# Altium project ESP232_USB_C_1.PrjPcb
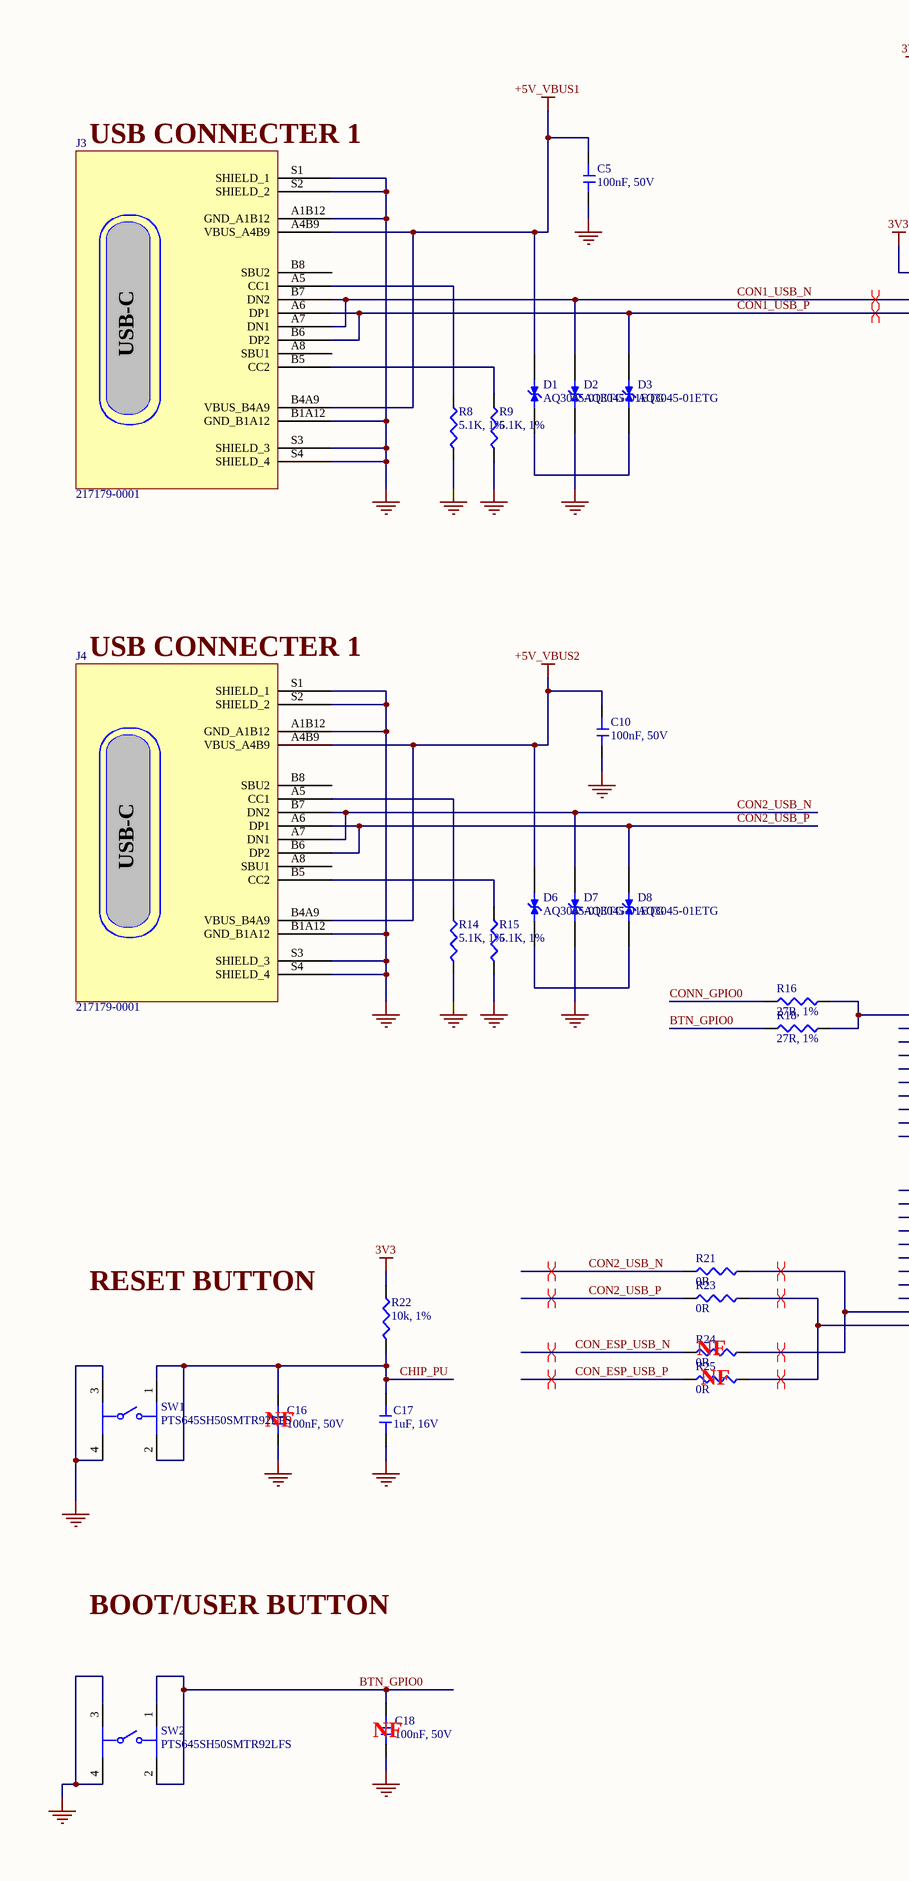
[diagram p0: ESP232_USB_C_SCH_1.SchDoc, left]
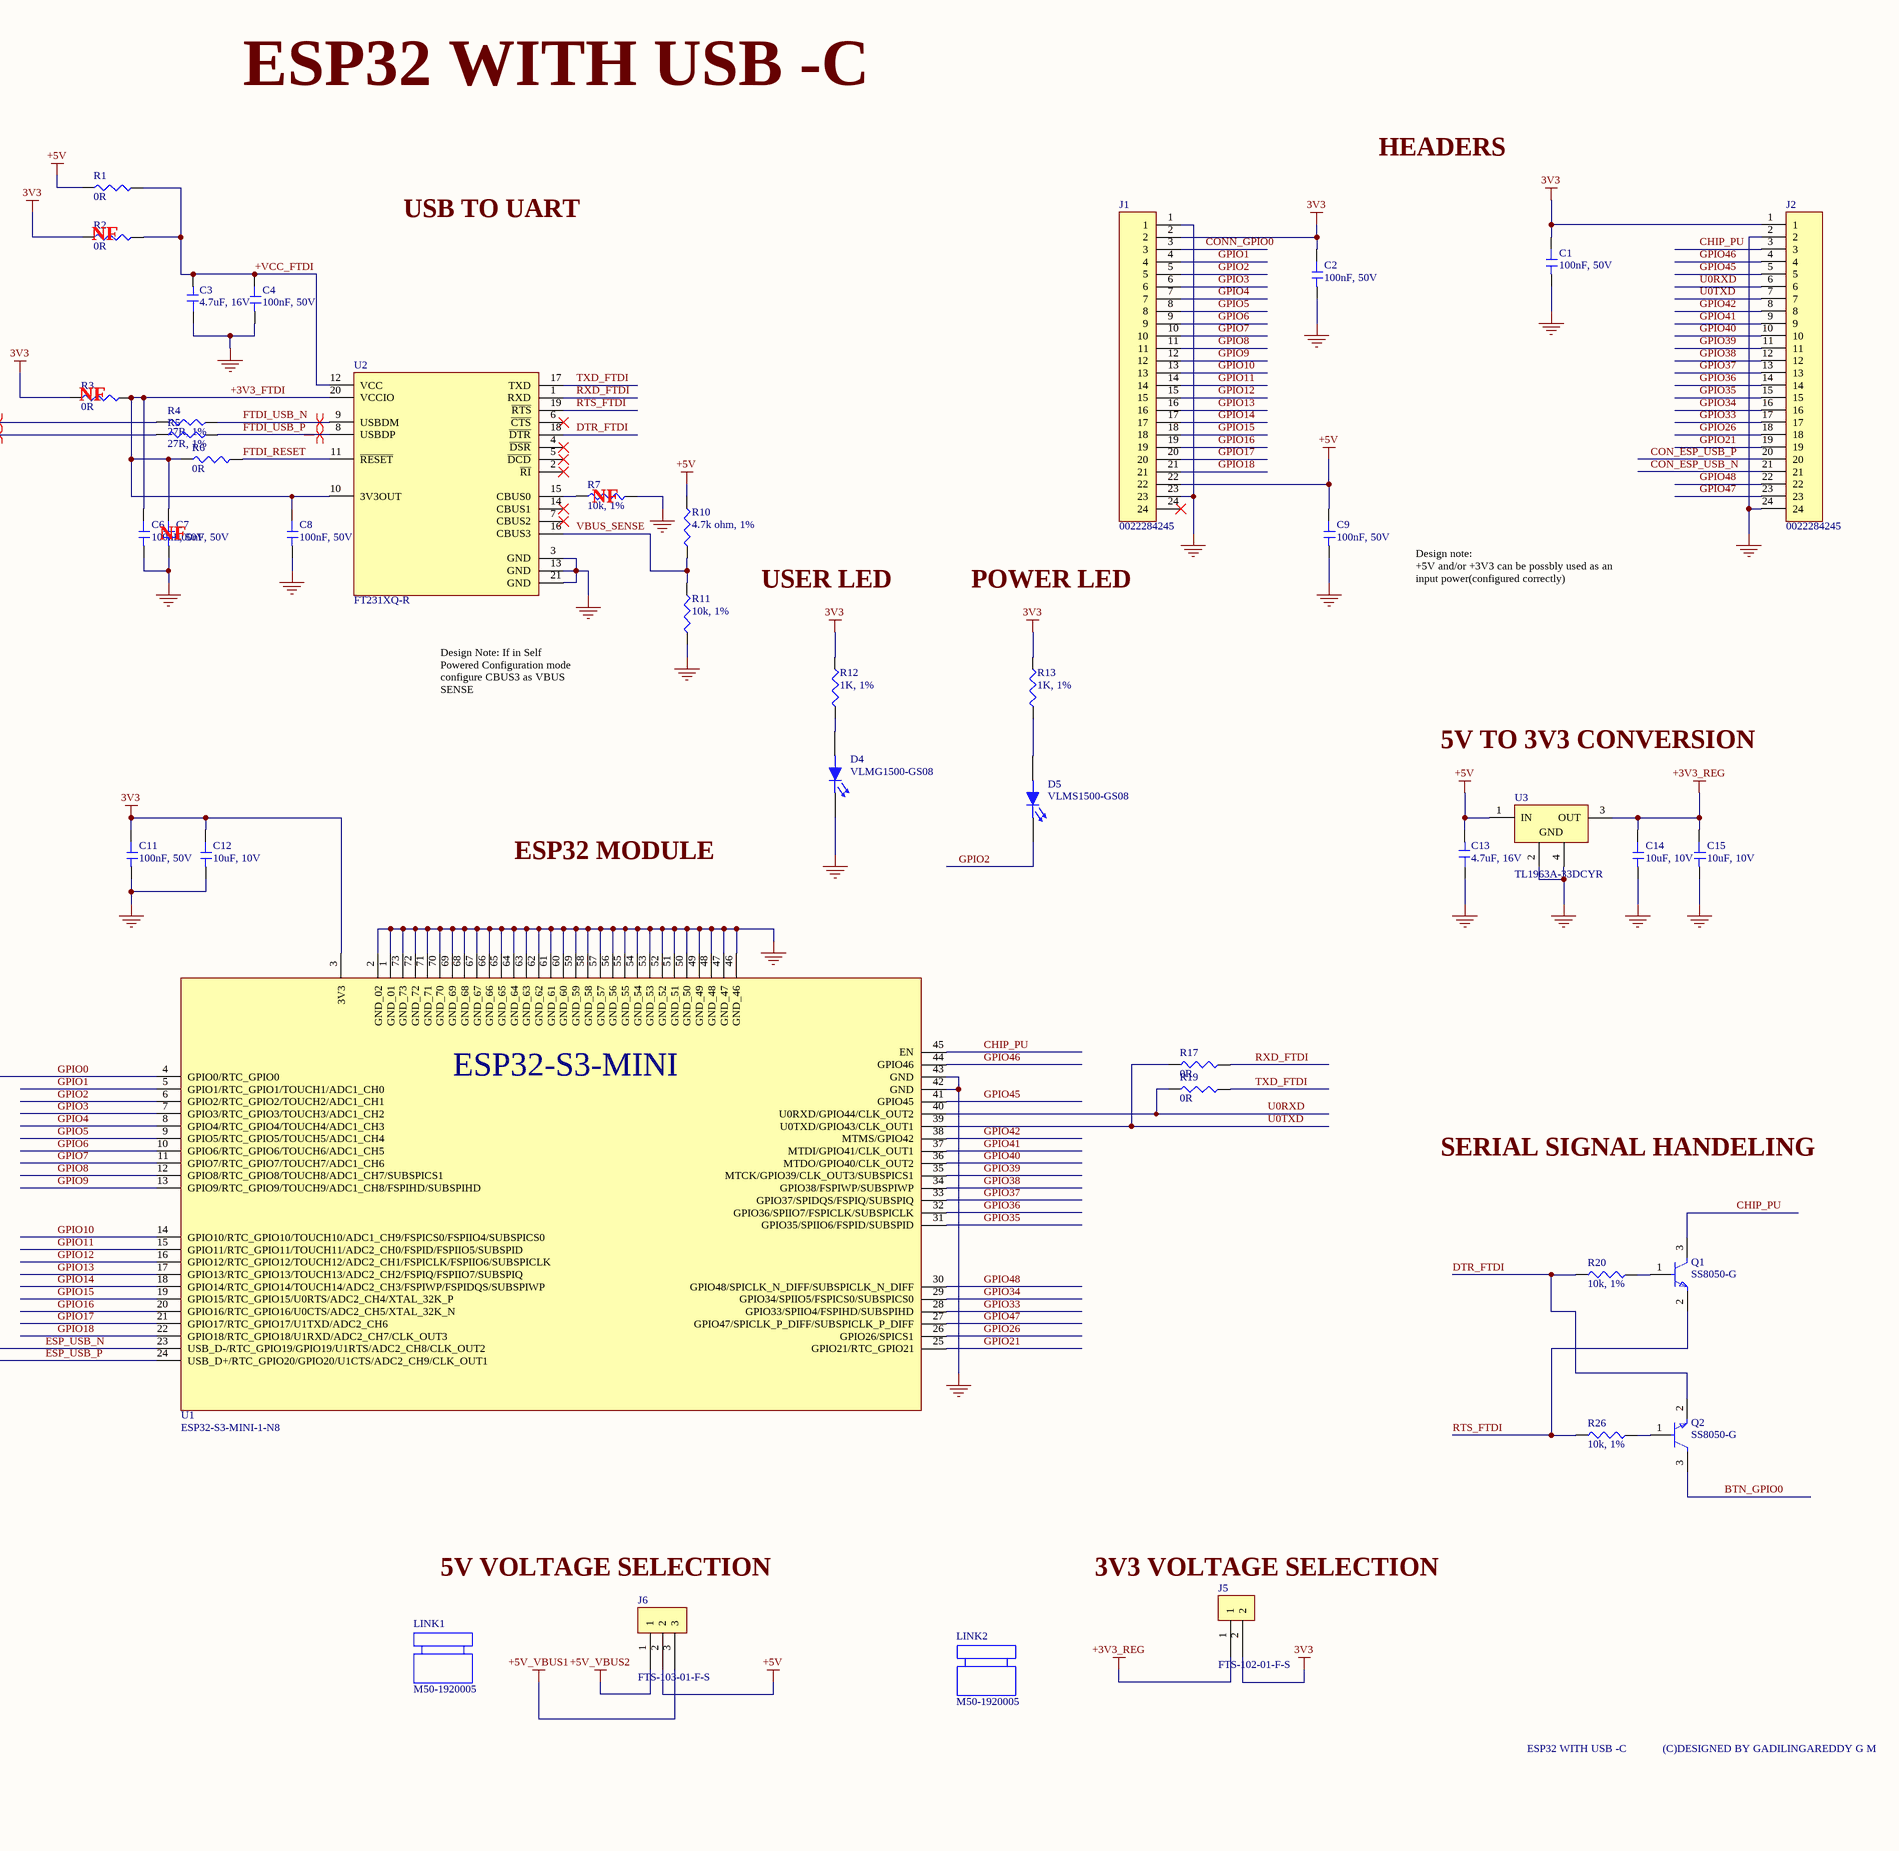
[diagram p1: ESP232_USB_C_SCH_1.SchDoc, right]
1 sheet, 67 parts. Net scope: global (net labels, ports and power ports of the same name join across sheets).
Board file: ESP232_USB_C_V1_2..PcbDoc

## Sheet ESP232_USB_C_SCH_1.SchDoc
size A2; SheetNumber: 1; SheetTotal: 1

### Parts
C1  100nF, 50V  [CAPC1005X55N]
C2  100nF, 50V  [CAPC1005X55N]
C3  4.7uF, 16V  [CAPC1005X55N]
C4  100nF, 50V  [CAPC1005X55N]
C5  100nF, 50V  [CAPC1005X55N]
C6  100nF, 50V  [CAPC1005X55N]
C7  100nF, 50V  [CAPC1005X55N]
C8  100nF, 50V  [CAPC1005X55N]
C9  100nF, 50V  [CAPC1005X55N]
C10  100nF, 50V  [CAPC1005X55N]
C11  100nF, 50V  [CAPC1005X55N]
C12  10uF, 10V  [CAPC1005X55N]
C13  4.7uF, 16V  [CAPC1005X55N]
C14  10uF, 10V  [CAPC1005X55N]
C15  10uF, 10V  [CAPC1005X55N]
C16  100nF, 50V  [CAPC1005X55N]
C17  1uF, 16V  [CAPC1005X55N]
C18  100nF, 50V  [CAPC1005X55N]
D1  AQ3045-01ETG  [ESD_TVS_DIODE]
D2  AQ3045-01ETG  [ESD_TVS_DIODE]
D3  AQ3045-01ETG  [ESD_TVS_DIODE]
D4  VLMG1500-GS08  [GREEN_LED]
D5  VLMS1500-GS08  [RED_LED]
D6  AQ3045-01ETG  [ESD_TVS_DIODE]
D7  AQ3045-01ETG  [ESD_TVS_DIODE]
D8  AQ3045-01ETG  [ESD_TVS_DIODE]
J1  0022284245  [HDR_1X24_2.54MM - duplicate]
J2  0022284245  [HDR_1X24_2.54MM - duplicate]
J3  217179-0001  [FP-2171790001-MFG]
J4  217179-0001  [FP-2171790001-MFG]
J5  FTS-102-01-F-S  [HDR_1X2_1.27MM]
J6  FTS-103-01-F-S  [HDR_1X3_1.27MM]
LINK1  M50-1920005  (mechanical)
LINK2  M50-1920005  (mechanical)
Q1  SS8050-G  [FP-SS8050-G-IPC_B]
Q2  SS8050-G  [FP-SS8050-G-IPC_B]
R1  0R  [RESC1005X37N]
R2  0R  [RESC1005X37N]
R3  0R  [RESC1005X37N]
R4  27R, 1%  [RESC1005X37N]
R5  27R, 1%  [RESC1005X37N]
R6  0R  [RESC1005X37N]
R7  10k, 1%  [RESC1005X37N]
R8  5.1K, 1%  [RESC1005X37N]
R9  5.1K, 1%  [RESC1005X37N]
R10  4.7k ohm, 1%  [RESC1005X37N]
R11  10k, 1%  [RESC1005X37N]
R12  1K, 1%  [RESC1005X37N]
R13  1K, 1%  [RESC1005X37N]
R14  5.1K, 1%  [RESC1005X37N]
R15  5.1K, 1%  [RESC1005X37N]
R16  27R, 1%  [RESC1005X37N]
R17  0R  [RESC1005X37N]
R18  27R, 1%  [RESC1005X37N]
R19  0R  [RESC1005X37N]
R20  10k, 1%  [RESC1005X37N]
R21  0R  [RESC1005X37N]
R22  10k, 1%  [RESC1005X37N]
R23  0R  [RESC1005X37N]
R24  0R  [RESC1005X37N]
R25  0R  [RESC1005X37N]
R26  10k, 1%  [RESC1005X37N]
SW1  PTS645SH50SMTR92LFS  [FP-PTS645SH50SMTR92LFS-MFG]
SW2  PTS645SH50SMTR92LFS  [FP-PTS645SH50SMTR92LFS-MFG]
U1  ESP32-S3-MINI-1-N8  [ESP32-S3-MINI-1-N8]
U2  FT231XQ-R  [FP-QFN-20-IPC_B]
U3  TL1963A-33DCYR  [DCY0004A_N]

### Nets
3V3: C1.2 C2.2 C11.2 C12.2 J1.2 J2.1 J5.2 R2.1 R3.1 R12.1 R13.1 R22.2 U1.3(3V3)
+3V3_REG: C14.2 C15.2 J5.1 U3.3(OUT)
+5V: C9.2 C13.1 J1.22 J6.2 R1.1 R10.1 U3.1(IN)
+5V_VBUS1: C5.2 D1.3 J3.A4B9(VBUS_A4B9) J3.B4A9(VBUS_B4A9) J6.3
+5V_VBUS2: C10.2 D6.3 J4.A4B9(VBUS_A4B9) J4.B4A9(VBUS_B4A9) J6.1
GND: C1.1 C2.1 C3.2 C4.1 C5.1 C6.1 C7.1 C8.1 C9.1 C10.1 C11.1 C12.1 C13.2 C14.1 C15.1 C16.1 C17.2 C18.1 D2.4 D4.26 D7.4 J1.1 J1.23 J2.2 J2.24 J3.A1B12(GND_A1B12) J3.B1A12(GND_B1A12) J3.S1(SHIELD_1) J3.S2(SHIELD_2) J3.S3(SHIELD_3) J3.S4(SHIELD_4) J4.A1B12(GND_A1B12) J4.B1A12(GND_B1A12) J4.S1(SHIELD_1) J4.S2(SHIELD_2) J4.S3(SHIELD_3) J4.S4(SHIELD_4) R7.2 R8.2 R9.2 R11.2 R14.2 R15.2 SW1.3 SW1.4 SW2.3 SW2.4 U1.1(GND_01) U1.2(GND_02) U1.42(GND) U1.43(GND) U1.46(GND_46) U1.47(GND_47) U1.48(GND_48) U1.49(GND_49) U1.50(GND_50) U1.51(GND_51) U1.52(GND_52) U1.53(GND_53) U1.54(GND_54) U1.55(GND_55) U1.56(GND_56) U1.57(GND_57) U1.58(GND_58) U1.59(GND_59) U1.60(GND_60) U1.61(GND_61) U1.62(GND_62) U1.63(GND_63) U1.64(GND_64) U1.65(GND_65) U1.66(GND_66) U1.67(GND_67) U1.68(GND_68) U1.69(GND_69) U1.70(GND_70) U1.71(GND_71) U1.72(GND_72) U1.73(GND_73) U2.3(GND) U2.13(GND) U2.21(GND) U3.2(GND) U3.4(GND)
+3V3_FTDI: C6.2 C7.2 C8.2 R3.2 R6.1 U2.10(3V3OUT) U2.20(VCCIO)
+VCC_FTDI: C3.1 C4.2 R1.2 R2.2 U2.12(VCC)
BTN_GPIO0: C18.2 Q2.3(C) R18.1 SW2.1 SW2.2
CHIP_PU: C16.2 C17.1 J2.3 Q1.3(C) R22.1 SW1.1 SW1.2 U1.45(EN)
CON1_USB_N: D2.3 J3.A7(DN1) J3.B7(DN2) R4.1
CON1_USB_P: D3.3 J3.A6(DP1) J3.B6(DP2) R5.1
CON2_USB_N: D7.3 J4.A7(DN1) J4.B7(DN2) R21.1
CON2_USB_P: D8.3 J4.A6(DP1) J4.B6(DP2) R23.1
CON_ESP_USB_N: J2.21 R24.1
CON_ESP_USB_P: J2.20 R25.1
CONN_GPIO0: J1.3 R16.1
DTR_FTDI: Q2.2(E) R20.1 U2.18(~{DTR})
ESP_USB_N: R21.2 R24.2 U1.23(USB_D-/RTC_GPIO19/GPIO19/U1RTS/ADC2_CH8/CLK_OUT2)
ESP_USB_P: R23.2 R25.2 U1.24(USB_D+/RTC_GPIO20/GPIO20/U1CTS/ADC2_CH9/CLK_OUT1)
FTDI_RESET: R6.2 U2.11(~{RESET})
FTDI_USB_N: R4.2 U2.9(USBDM)
FTDI_USB_P: R5.2 U2.8(USBDP)
GPIO0: R16.2 R18.2 U1.4(GPIO0/RTC_GPIO0)
GPIO1: J1.4 U1.5(GPIO1/RTC_GPIO1/TOUCH1/ADC1_CH0)
GPIO2: D5.26 J1.5 U1.6(GPIO2/RTC_GPIO2/TOUCH2/ADC1_CH1)
GPIO3: J1.6 U1.7(GPIO3/RTC_GPIO3/TOUCH3/ADC1_CH2)
GPIO4: J1.7 U1.8(GPIO4/RTC_GPIO4/TOUCH4/ADC1_CH3)
GPIO5: J1.8 U1.9(GPIO5/RTC_GPIO5/TOUCH5/ADC1_CH4)
GPIO6: J1.9 U1.10(GPIO6/RTC_GPIO6/TOUCH6/ADC1_CH5)
GPIO7: J1.10 U1.11(GPIO7/RTC_GPIO7/TOUCH7/ADC1_CH6)
GPIO8: J1.11 U1.12(GPIO8/RTC_GPIO8/TOUCH8/ADC1_CH7/SUBSPICS1)
GPIO9: J1.12 U1.13(GPIO9/RTC_GPIO9/TOUCH9/ADC1_CH8/FSPIHD/SUBSPIHD)
GPIO10: J1.13 U1.14(GPIO10/RTC_GPIO10/TOUCH10/ADC1_CH9/FSPICS0/FSPIIO4/SUBSPICS0)
GPIO11: J1.14 U1.15(GPIO11/RTC_GPIO11/TOUCH11/ADC2_CH0/FSPID/FSPIIO5/SUBSPID)
GPIO12: J1.15 U1.16(GPIO12/RTC_GPIO12/TOUCH12/ADC2_CH1/FSPICLK/FSPIIO6/SUBSPICLK)
GPIO13: J1.16 U1.17(GPIO13/RTC_GPIO13/TOUCH13/ADC2_CH2/FSPIQ/FSPIIO7/SUBSPIQ)
GPIO14: J1.17 U1.18(GPIO14/RTC_GPIO14/TOUCH14/ADC2_CH3/FSPIWP/FSPIDQS/SUBSPIWP)
GPIO15: J1.18 U1.19(GPIO15/RTC_GPIO15/U0RTS/ADC2_CH4/XTAL_32K_P)
GPIO16: J1.19 U1.20(GPIO16/RTC_GPIO16/U0CTS/ADC2_CH5/XTAL_32K_N)
GPIO17: J1.20 U1.21(GPIO17/RTC_GPIO17/U1TXD/ADC2_CH6)
GPIO18: J1.21 U1.22(GPIO18/RTC_GPIO18/U1RXD/ADC2_CH7/CLK_OUT3)
GPIO21: J2.19 U1.25(GPIO21/RTC_GPIO21)
GPIO26: J2.18 U1.26(GPIO26/SPICS1)
GPIO33: J2.17 U1.28(GPIO33/SPIIO4/FSPIHD/SUBSPIHD)
GPIO34: J2.16 U1.29(GPIO34/SPIIO5/FSPICS0/SUBSPICS0)
GPIO35: J2.15 U1.31(GPIO35/SPIIO6/FSPID/SUBSPID)
GPIO36: J2.14 U1.32(GPIO36/SPIIO7/FSPICLK/SUBSPICLK)
GPIO37: J2.13 U1.33(GPIO37/SPIDQS/FSPIQ/SUBSPIQ)
GPIO38: J2.12 U1.34(GPIO38/FSPIWP/SUBSPIWP)
GPIO39: J2.11 U1.35(MTCK/GPIO39/CLK_OUT3/SUBSPICS1)
GPIO40: J2.10 U1.36(MTDO/GPIO40/CLK_OUT2)
GPIO41: J2.9 U1.37(MTDI/GPIO41/CLK_OUT1)
GPIO42: J2.8 U1.38(MTMS/GPIO42)
GPIO45: J2.5 U1.41(GPIO45)
GPIO46: J2.4 U1.44(GPIO46)
GPIO47: J2.23 U1.27(GPIO47/SPICLK_P_DIFF/SUBSPICLK_P_DIFF)
GPIO48: J2.22 U1.30(GPIO48/SPICLK_N_DIFF/SUBSPICLK_N_DIFF)
RTS_FTDI: Q1.2(E) R26.1 U2.19(~{RTS})
RXD_FTDI: R17.2 U2.1(RXD)
TXD_FTDI: R19.2 U2.17(TXD)
U0RXD: J2.6 R19.1 U1.40(U0RXD/GPIO44/CLK_OUT2)
U0TXD: J2.7 R17.1 U1.39(U0TXD/GPIO43/CLK_OUT1)
VBUS_SENSE: R10.2 R11.1 U2.16(CBUS3)
NetD1_4: D1.4 D3.4
NetD4_25: D4.25 R12.2
NetD5_25: D5.25 R13.2
NetD6_4: D6.4 D8.4
NetJ3_A5: J3.A5(CC1) R8.1
NetJ3_B5: J3.B5(CC2) R9.1
NetJ4_A5: J4.A5(CC1) R14.1
NetJ4_B5: J4.B5(CC2) R15.1
NetQ1_1: Q1.1(B) R20.2
NetQ2_1: Q2.1(B) R26.2
NetR7_1: R7.1 U2.15(CBUS0)

Not connected (* = marked no-connect by the designer): J1 24*; J3 A8(SBU1) B8(SBU2); J4 A8(SBU1) B8(SBU2); U2 2(~{RI})* 4(~{DSR})* 5(~{DCD})* 6(~{CTS})* 7(CBUS2)* 14(CBUS1)*

### Layout directives
differential pair; differential pair class DIFF90: CON1_USB_N, CON1_USB_P, CON2_USB_N, CON2_USB_P, CON_ESP_USB_N, CON_ESP_USB_P, ESP_USB_N, ESP_USB_P, FTDI_USB_N, FTDI_USB_P

### Notes on the sheet
- ESP32 WITH USB -C
- HEADERS
- USB TO UART
- (near J3) USB CONNECTER 1
- (near R2) NF
- (near R3) NF
- (near C7) NF
- (near R7) NF
- USER LED
- POWER LED
- Design note:
  +5V and/or +3V3 can be possbly used as an input power(configured correctly)
- Design Note: If in Self Powered Configuration mode configure CBUS3 as VBUS SENSE
- (near J4) USB CONNECTER 1
- 5V TO 3V3 CONVERSION
- ESP32 MODULE
- SERIAL SIGNAL HANDELING
- RESET BUTTON
- (near R24) NF
- (near C16) NF
- (near R25) NF
- (near LINK1) 5V VOLTAGE SELECTION
- (near J5) 3V3 VOLTAGE SELECTION
- BOOT/USER BUTTON
- (near C18) NF
- (C)DESIGNED BY GADILINGAREDDY G M
- (in symbol 217179-0001) USB-C
- (in symbol ESP32-S3-MINI-1-N8) ESP32-S3-MINI

### Library data of the parts
C1 C2 C4-C11 C16 C18 = CL05B104KB54PNC: CAP CER 0.1UF 50V X7R 0402; Manufacturer: Samsung; Material: 4241ConductorMaterial; Tolerance: 10%; Supplier: Digikey; Supplier Part Number: 1276-CL05B104KB54PNCCT-ND; Manufacturer Part Number: CL05B104KB54PNC; RoHS: Yes; Category: Ceramic Capacitors; Stock: 1622536; Pricing: 1=0.1, 10=0.036, 50=0.0244, 100=0.0209, 500=0.01492, 1000=0.01307, 2500=0.0111, 5000=0.00992, 10000=0.00896, 20000=0.00814, 30000=0.00773, 50000=0.00728, 70000=0.00701, 100000=0.00675, 250000=0.00619, 500000=0.00585, 1000000=0.00557 (USD); Case/Package: 343Case; Min Operating Temperature: -55°C; Max Operating Temperature: 125°C; Voltage Rating: 50V; Value: 100nF; Height: 550um; RoHS Compliant: Yes; ComponentLink1URL: https://datasheet.octopart.com/CL05B104KB54PNC-Samsung-datasheet-8326407.pdf?src-supplier=TME; ComponentLink1Description: https://datasheet.octopart.com/CL05B104KB54PNC-Samsung-datasheet-8326407.pdf?src-supplier=TME; LCSC Part Number: C307331
C3 C13 = CL05A475MO5NUNC: CAP CER 4.7UF 16V X5R 0402; Manufacturer: Samsung; Material: 4241ConductorMaterial; Tolerance: 20%; Supplier: Digikey; Supplier Part Number: 1276-6836-1-ND; Manufacturer Part Number: CL05A475MO5NUNC; RoHS: Yes; Category: Ceramic Capacitors; Stock: 106959; Pricing: 1=0.31, 10=0.146, 50=0.1232, 100=0.1, 500=0.0952, 1000=0.0904, 2500=0.0752 (USD); Mounting Technology: Surface Mount; Case/Package: 0402; Case Code (Metric): 1005; Case Code (Imperial): 0402; Min Operating Temperature: -55°C; Max Operating Temperature: 85°C; Packaging: Cut Tape; Value: 4.7uF; Voltage Rating: 16V; Series: CL; Voltage Rating (DC): 16V; Length: 0.039inch; Width: 0.02inch; Height: 550um; Thickness: 0.022inch; RoHS Compliant: Yes; ComponentLink1URL: http://www.farnell.com/datasheets/2710653.pdf?src-supplier=Farnell; ComponentLink1Description: http://www.farnell.com/datasheets/2710653.pdf?src-supplier=Farnell; ComponentLink2URL: http://www.samsungsem.com/kr/support/product-search/mlcc/CL05A475MO5NUNC.jsp?src-supplier=Digikey; ComponentLink2Description: http://www.samsungsem.com/kr/support/product-search/mlcc/CL05A475MO5NUNC.jsp?src-supplier=Digikey; ComponentLink3URL: http://www.farnell.com/datasheets/2710653.pdf?src-supplier=Element14; ComponentLink3Description: http://www.farnell.com/datasheets/2710653.pdf?src-supplier=Element14; ComponentLink4URL: https://datasheet.octopart.com/CL05A475MO5NUNC-Samsung-Electro-Mechanics-datasheet-123102911.pdf?src-supplier=Future+Electronics; ComponentLink4Description: https://datasheet.octopart.com/CL05A475MO5NUNC-Samsung-Electro-Mechanics-datasheet-123102911.pdf?src-supplier=Future+Electronics; ComponentLink5URL: http://www.farnell.com/datasheets/2710653.pdf?src-supplier=Newark; ComponentLink5Description: http://www.farnell.com/datasheets/2710653.pdf?src-supplier=Newark; LCSC Part Number: C318563
C12 C14 C15 = CL05A106MP8NUB8: CAP CER 10UF 10V X5R 0402; Manufacturer: Samsung; Material: 4241ConductorMaterial; Tolerance: 20%; Supplier: Digikey; Supplier Part Number: 1276-6830-1-ND; Manufacturer Part Number: CL05A106MP8NUB8; RoHS: Yes; Category: Ceramic Capacitors; Stock: 375898; Pricing: 1=0.26, 10=0.121, 50=0.1012, 100=0.0816, 500=0.0752, 1000=0.0688, 2500=0.0584, 8000=0.056 (USD); Mounting Technology: Surface Mount; Case/Package: 0402; Case Code (Metric): 1005; Case Code (Imperial): 0402; Min Operating Temperature: -55°C; Max Operating Temperature: 85°C; Packaging: Cut Tape; Value: 10uF; Voltage Rating: 10V; Series: CL; Length: 0.039inch; Width: 0.02inch; Height: 550um; Thickness: 0.035inch; RoHS Compliant: Yes; ComponentLink1URL: http://www.samsungsem.com/kr/support/product-search/mlcc/CL05A106MP8NUB8.jsp?src-supplier=Digikey; ComponentLink1Description: http://www.samsungsem.com/kr/support/product-search/mlcc/CL05A106MP8NUB8.jsp?src-supplier=Digikey; ComponentLink2URL: https://datasheet.octopart.com/CL05A106MP8NUB8-Samsung-Electro-Mechanics-datasheet-136460857.pdf?src-supplier=Future+Electronics; ComponentLink2Description: https://datasheet.octopart.com/CL05A106MP8NUB8-Samsung-Electro-Mechanics-datasheet-136460857.pdf?src-supplier=Future+Electronics; LCSC Part Number: C307415
C17 = CL05A105KO5NNNC: CAP CER 1UF 16V X5R 0402; Manufacturer: Samsung; Material: 4241ConductorMaterial; Tolerance: 10%; Supplier: Digikey; Supplier Part Number: 1276-1067-1-ND; Manufacturer Part Number: CL05A105KO5NNNC; RoHS: Yes; Category: Ceramic Capacitors; Stock: 2148876; Pricing: 1=0.08, 10=0.018, 50=0.0144, 100=0.0112, 500=0.01, 1000=0.0088, 2500=0.0072, 10000=0.0056, 20000=0.0048 (USD); Mounting Technology: Surface Mount; Case/Package: 0402; Case Code (Metric): 1005; Case Code (Imperial): 0402; Min Operating Temperature: -55°C; Max Operating Temperature: 85°C; Value: 1uF; Dielectric: X5R; Packaging: Tape and Reel; Package Quantity: 1; Voltage Rating: 16V; Voltage: 16V; Series: CL; Construction: Flat; Voltage Rating (DC): 16V; Length: 1mm; Width: 0.02inch; Height: 0.5mm; Thickness: 0.022inch; Depth: 0.5mm; Radiation Hardening: No; RoHS Compliant: Yes; ComponentLink1URL: https://datasheet.ciiva.com/16207/cl05a105ko5nnnc-16207571.pdf?src-supplier=Future+Electronics; ComponentLink1Description: https://datasheet.ciiva.com/16207/cl05a105ko5nnnc-16207571.pdf?src-supplier=Future+Electronics; ComponentLink2URL: https://datasheet.ciiva.com/15195/getdatasheetpartid-355272-15195629.pdf?src-supplier=Verical; ComponentLink2Description: https://datasheet.ciiva.com/15195/getdatasheetpartid-355272-15195629.pdf?src-supplier=Verical; LCSC Part Number: C29266
D1-D3 D6-D8 = AQ3045-01ETG: TVS DIODE 5.3VWM 12VC SOD882; Manufacturer: Littelfuse; Number of Bidirectional Channels: 1; Reverse Standoff Voltage: 5.3V; Min Breakdown Voltage: 6.8V; Peak Pulse Current: 3A; Peak Pulse Power: 40W; Power Line Protection: No; Diode Type: ZENER; Leakage Current: 100nA; Number of Channels: 1NUMBER; Supplier: Digikey; Supplier Part Number: F9321CT-ND; Manufacturer Part Number: AQ3045-01ETG; RoHS: Yes; Category: TVS Diodes; Stock: 16668; Pricing: 1=0.48, 10=0.321, 100=0.17, 500=0.152, 1000=0.134, 2000=0.13, 5000=0.126 (USD); Mounting Technology: Surface Mount; Min Operating Temperature: -55°C; Max Operating Temperature: 150°C; Packaging: Cut Tape; Series: Automotive, AEC-Q101, AQ3045, SPA®; Operating Supply Voltage: 5.3V; RoHS Compliant: Yes; ComponentLink1URL: https://www.littelfuse.com/~/media/electronics/datasheets/tvs_diode_arrays/littelfuse_tvs_diode_array_aq3045_datasheet.pdf.pdf?src-supplier=Digikey; ComponentLink1Description: https://www.littelfuse.com/~/media/electronics/datasheets/tvs_diode_arrays/littelfuse_tvs_diode_array_aq3045_datasheet.pdf.pdf?src-supplier=Digikey; ComponentLink2URL: http://www.littelfuse.com/~/media/electronics/datasheets/tvs_diode_arrays/littelfuse_tvs_diode_array_aq3045_datasheet.pdf.pdf?src-supplier=Digikey; ComponentLink2Description: http://www.littelfuse.com/~/media/electronics/datasheets/tvs_diode_arrays/littelfuse_tvs_diode_array_aq3045_datasheet.pdf.pdf?src-supplier=Digikey; LCSC Part Number: C3710326
D4 = VLMG1500-GS08: LED YLW-GRN 0402 SMD; Manufacturer: Vishay; Color: Green,Yellow; Lens Color: Clear; Viewing Angle: 130°; Illumination Color: Green; Forward Current: 30mA; Forward Voltage: 2V; Luminous Intensity: 35mcd; Dominant Wavelength: 571nm; Test Current: 20mA; Number of Elements: 1; Power Dissipation: 75mW; Lens Style: Rectangular; Reverse Voltage: 5V; Supplier: Digikey; Supplier Part Number: VLMG1500-GS08CT-ND; Manufacturer Part Number: VLMG1500-GS08; RoHS: Yes; Category: LEDs; Stock: 73108; Pricing: 1=0.33, 10=0.189, 100=0.1166, 500=0.08838, 1000=0.07977 (USD); Mounting Technology: Surface Mount; Case/Package: 0402; Pins: 2; Case Code (Metric): 1005; Case Code (Imperial): 0402; Min Operating Temperature: -30°C; Max Operating Temperature: 85°C; Package Quantity: 1; Packaging: Tape and Reel; Wavelength: 571nm; Number of LEDs: 1; Power Rating: 75mW; Series: CHipLED; Length: 1mm; Width: 0.5mm; Height: 0.35mm; Depth: 0.5mm; Radiation Hardening: No; Lead Free: Lead Free; RoHS Compliant: Yes; Reach SVHC Compliant: Unknown; ComponentLink1URL: https://datasheet.ciiva.com/12071/vlmo1500-244705-12071911.pdf?src-supplier=Mouser; ComponentLink1Description: https://datasheet.ciiva.com/12071/vlmo1500-244705-12071911.pdf?src-supplier=Mouser; ComponentLink2URL: https://datasheet.ciiva.com/30005/vlmo1500-30005134.pdf?src-supplier=Avnet; ComponentLink2Description: https://datasheet.ciiva.com/30005/vlmo1500-30005134.pdf?src-supplier=Avnet; LCSC Part Number: C511404
D5 = VLMS1500-GS08: LED RED 0402 SMD; Manufacturer: Vishay; Viewing Angle: 130°; Forward Current: 30mA; Forward Voltage: 2V; Luminous Intensity: 54mcd; Dominant Wavelength: 631nm; Test Current: 20mA; Lens Style: Flat,Rectangular,Square; Number of LEDs: 1; Power Rating: 75mW; Lens Size: 0.5mm; Supplier: Digikey; Supplier Part Number: VLMS1500-GS08CT-ND; Manufacturer Part Number: VLMS1500-GS08; RoHS: Yes; Category: LEDs; Stock: 29337; Pricing: 1=0.33, 10=0.189, 100=0.1166, 500=0.08838, 1000=0.07977 (USD); Mounting Technology: Surface Mount; Case/Package: 0402; Pins: 2; Color: Red; Case Code (Metric): 1005; Case Code (Imperial): 0402; Min Operating Temperature: -30°C; Max Operating Temperature: 85°C; Package Quantity: 9000; Packaging: Tape and Reel; Illumination Color: Red; Wavelength: 631nm; Series: CHipLED; Length: 1mm; Width: 0.5mm; Height: 0.55mm; Radiation Hardening: No; Lead Free: Lead Free; RoHS Compliant: Yes; Reach SVHC Compliant: Unknown; ComponentLink1URL: http://components.arrow.com/part/dataview/56357384S461524N5680?src-supplier=Arrow+Electronics; ComponentLink1Description: http://components.arrow.com/part/dataview/56357384S461524N5680?src-supplier=Arrow+Electronics; ComponentLink2URL: http://www.mouser.com/ds/2/427/vlmo1500-244705.pdf?src-supplier=Mouser; ComponentLink2Description: http://www.mouser.com/ds/2/427/vlmo1500-244705.pdf?src-supplier=Mouser; ComponentLink3URL: http://www.farnell.com/datasheets/1809983.pdf?src-supplier=Farnell; ComponentLink3Description: http://www.farnell.com/datasheets/1809983.pdf?src-supplier=Farnell; ComponentLink4URL: http://www.alliedelec.com/m/d/cfc385e1097fc985ee9a50a3551ac188.pdf?src-supplier=Allied+Electronics; ComponentLink4Description: http://www.alliedelec.com/m/d/cfc385e1097fc985ee9a50a3551ac188.pdf?src-supplier=Allied+Electronics; ComponentLink5URL: https://datasheet.octopart.com/VLMS1500-GS08-Vishay-datasheet-62332426.pdf?src-supplier=Newark; ComponentLink5Description: https://datasheet.octopart.com/VLMS1500-GS08-Vishay-datasheet-62332426.pdf?src-supplier=Newark; ComponentLink6URL: http://www.vishay.com/docs/82554/vlmo1500.pdf?src-supplier=Avnet; ComponentLink6Description: http://www.vishay.com/docs/82554/vlmo1500.pdf?src-supplier=Avnet; ComponentLink7URL: https://datasheet.octopart.com/VLMS1500-GS08-Vishay-datasheet-21227148.pdf?src-supplier=Future+Electronics; ComponentLink7Description: https://datasheet.octopart.com/VLMS1500-GS08-Vishay-datasheet-21227148.pdf?src-supplier=Future+Electronics; ComponentLink8URL: http://www.farnell.com/datasheets/2050839.pdf?src-supplier=Newark; ComponentLink8Description: http://www.farnell.com/datasheets/2050839.pdf?src-supplier=Newark; ComponentLink9URL: http://www.farnell.com/datasheets/1809983.pdf?src-supplier=Element14; ComponentLink9Description: http://www.farnell.com/datasheets/1809983.pdf?src-supplier=Element14; ComponentLink10URL: https://datasheet.octopart.com/VLMS1500-GS08-Vishay-datasheet-33014519.pdf?src-supplier=Element14; ComponentLink10Description: https://datasheet.octopart.com/VLMS1500-GS08-Vishay-datasheet-33014519.pdf?src-supplier=Element14; ComponentLink11URL: http://www.farnell.com/datasheets/1809983.pdf?src-supplier=Newark; ComponentLink11Description: http://www.farnell.com/datasheets/1809983.pdf?src-supplier=Newark; ComponentLink12URL: http://datasheet.octopart.com/VLMS1500-GS08-Vishay-datasheet-21227148.pdf?src-supplier=Avnet; ComponentLink12Description: http://datasheet.octopart.com/VLMS1500-GS08-Vishay-datasheet-21227148.pdf?src-supplier=Avnet; ComponentLink13URL: http://datasheet.octopart.com/VLMS1500-GS08-Vishay-datasheet-21227148.pdf?src-supplier=LCSC; ComponentLink13Description: http://datasheet.octopart.com/VLMS1500-GS08-Vishay-datasheet-21227148.pdf?src-supplier=LCSC; ComponentLink14URL: http://datasheet.octopart.com/VLMS1500-GS08-Vishay-datasheet-21227148.pdf?src-supplier=Quest; ComponentLink14Description: http://datasheet.octopart.com/VLMS1500-GS08-Vishay-datasheet-21227148.pdf?src-supplier=Quest; ComponentLink15URL: http://datasheet.octopart.com/VLMS1500-GS08-Vishay-datasheet-21227148.pdf?src-supplier=NAC+Semi; ComponentLink15Description: http://datasheet.octopart.com/VLMS1500-GS08-Vishay-datasheet-21227148.pdf?src-supplier=NAC+Semi; LCSC Part Number: C511370
J1 J2 = 0022284245: CONN HEADER VERT 24POS 2.54MM; Manufacturer: Molex; Current Rating: 4A; Voltage Rating: 250V; Number of Positions: 24; Gender: Male; Glow Wire Compliant: Non-compliant; Supplier: Digikey; Supplier Part Number: 900-0022284245-ND; Manufacturer Part Number: 0022284245; RoHS: Yes; Category: Uncategorized; Stock: 2848; Pricing: 1=1.21, 10=0.982, 100=0.8001, 500=0.6936, 1000=0.65226, 5000=0.57911 (USD); Mounting Technology: Through Hole; Contact Plating: Gold; Contact Material: Brass; Color: Black; Housing Color: Black; Housing Material: Thermoplastic; Contact Shape: Square; Contact Finish - Mating: GOLD; Insulation Material: Nylon; Insulation Color: Black; Number of Rows: 1; Packaging: Bulk; Package Quantity: 1; Termination: Solder; Number of Contacts: 24; Orientation: Vertical; Number of Circuits: 24; Series: 42375; Contact Type: Male Pin; Fastening Type: Pull; Pitch: 2.54mm; Contact Mating Length: 0.295inch; Lead Free: Lead Free; RoHS Compliant: Yes; Flammability Rating: UL94 V-0; ComponentLink1URL: https://datasheet.ciiva.com/6814/022284363-sd-6814049.pdf?src-supplier=Digikey; ComponentLink1Description: https://datasheet.ciiva.com/6814/022284363-sd-6814049.pdf?src-supplier=Digikey; ComponentLink2URL: https://datasheet.ciiva.com/5153/0022284245-pcb-headers-228340-5153875.pdf?src-supplier=Mouser; ComponentLink2Description: https://datasheet.ciiva.com/5153/0022284245-pcb-headers-228340-5153875.pdf?src-supplier=Mouser; ComponentLink3URL: https://datasheet.ciiva.com/10075/0022284245-pcb-headers-10075617.pdf?src-supplier=Avnet; ComponentLink3Description: https://datasheet.ciiva.com/10075/0022284245-pcb-headers-10075617.pdf?src-supplier=Avnet; ComponentLink4URL: https://datasheet.ciiva.com/1433/1597854-1433759.pdf?src-supplier=Element14; ComponentLink4Description: https://datasheet.ciiva.com/1433/1597854-1433759.pdf?src-supplier=Element14; LCSC Part Number: C7145888
J3 J4 = 217179-0001: CONN RCP USB2.0 TYP C 24P SMD RA; Manufacturer: Molex; Current Rating: 1.25A; Gender: Receptacle; Number of Contacts: 16; Voltage Rating: 30V; Supplier: Digikey; Supplier Part Number: 900-2171790001CT-ND; Manufacturer Part Number: 217179-0001; RoHS: No; Category: Connectors; Stock: 11718; Pricing: 1=0.79, 10=0.645, 25=0.5948, 50=0.5594, 100=0.5259, 250=0.48484, 500=0.45592, 1200=0.42188, 2400=0.39674, 3600=0.38274, 6000=0.366 (USD); Contact Material: Nickel,Gold; Min Operating Temperature: -40°C; Max Operating Temperature: 85°C; USB Standard: USB 2.0; Height: 3.36mm; LCSC Part Number: C2894899
J5 = FTS-102-01-F-S: CONN HEADER VERT 2POS 1.27MM; Manufacturer: Samtec; Number of Contacts: 2; Gender: Male; Supplier: Digikey; Supplier Part Number: SAM15176-ND; Manufacturer Part Number: FTS-102-01-F-S; RoHS: Yes; Category: Connectors; Stock: 422; Pricing: 1=0.49, 50=0.4252, 100=0.3608, 500=0.2994, 1000=0.25609, 2000=0.20954, 5000=0.16589, 10000=0.1625 (USD); Mounting Technology: Through Hole; Contact Plating: Gold; Contact Material: Bronze; Contact Shape: Square; Contact Finish - Mating: GOLD; Insulation Material: Polymer; Insulation Color: Black; Min Operating Temperature: -55°C; Max Operating Temperature: 125°C; Number of Rows: 1; Packaging: Bulk; Termination: Solder; Fastening Type: Pull; Series: FTS; Contact Type: Male Pin; Number of Positions: 2; Pitch: 1.27mm; Radiation Hardening: No; RoHS Compliant: Yes; Flammability Rating: UL94 V-0; ComponentLink1URL: http://www.samtec.com/documents/webfiles/pdf/FTS.pdf?src-supplier=Avnet; ComponentLink1Description: http://www.samtec.com/documents/webfiles/pdf/FTS.pdf?src-supplier=Avnet; LCSC Part Number: C6045317
J6 = FTS-103-01-F-S: CONN HEADER VERT 3POS 1.27MM; Manufacturer: Samtec; Supplier: Digikey; Supplier Part Number: 612-FTS-103-01-F-S-ND; Manufacturer Part Number: FTS-103-01-F-S; RoHS: Yes; Category: Connectors; Stock: 2615; Pricing: 1=0.73, 50=0.6378, 100=0.5407, 500=0.4491, 1000=0.38362, 2000=0.31431, 5000=0.2478, 10000=0.2375 (USD); ComponentLink1URL: http://www.samtec.com/documents/webfiles/pdf/FTS.pdf?src-supplier=Avnet; ComponentLink1Description: http://www.samtec.com/documents/webfiles/pdf/FTS.pdf?src-supplier=Avnet; ComponentLink2URL: http://suddendocs.samtec.com/prints/fts-1xx-xx-xx-xx-xx-mkt.pdf?src-supplier=Digikey; ComponentLink2Description: http://suddendocs.samtec.com/prints/fts-1xx-xx-xx-xx-xx-mkt.pdf?src-supplier=Digikey; ComponentLink3URL: https://datasheet.octopart.com/FTS-103-01-F-S-Samtec-datasheet-116535195.pdf?src-supplier=Toby+Electronics; ComponentLink3Description: https://datasheet.octopart.com/FTS-103-01-F-S-Samtec-datasheet-116535195.pdf?src-supplier=Toby+Electronics; ComponentLink4URL: https://datasheet.octopart.com/FTS-103-01-F-S-Samtec-datasheet-151470456.pdf?src-supplier=Sager+Electronics; ComponentLink4Description: https://datasheet.octopart.com/FTS-103-01-F-S-Samtec-datasheet-151470456.pdf?src-supplier=Sager+Electronics; LCSC Part Number: C3333578
LINK1 LINK2 = M50-1920005: CONN SHUNT 1.27MM RED; Manufacturer: Harwin; Supplier: Digikey; Supplier Part Number: 952-1727-ND; Manufacturer Part Number: M50-1920005; RoHS: Yes; Category: Headers and Wire Housings; Stock: 2184; Pricing: 1=0.33, 10=0.273, 25=0.2512, 50=0.2362, 100=0.222, 250=0.20468, 500=0.19246, 1000=0.18098, 3000=0.16418 (USD); ComponentLink1URL: https://datasheet.ciiva.com/4573/m50-19x-350826-4573042.pdf?src-supplier=Mouser; ComponentLink1Description: https://datasheet.ciiva.com/4573/m50-19x-350826-4573042.pdf?src-supplier=Mouser; ComponentLink2URL: https://datasheet.ciiva.com/767/m50-19x-767921.pdf?src-supplier=Digikey; ComponentLink2Description: https://datasheet.ciiva.com/767/m50-19x-767921.pdf?src-supplier=Digikey; ComponentLink3URL: https://datasheet.ciiva.com/1412/1836978-1412125.pdf?src-supplier=Element14; ComponentLink3Description: https://datasheet.ciiva.com/1412/1836978-1412125.pdf?src-supplier=Element14; ComponentLink4URL: https://datasheet.ciiva.com/1456/m50-19x-1456640.pdf?src-supplier=Newark; ComponentLink4Description: https://datasheet.ciiva.com/1456/m50-19x-1456640.pdf?src-supplier=Newark; LCSC Part Number: C6985646
Q1 Q2 = SS8050-G: TRANS NPN 25V 1.5A SOT23-3; Manufacturer: Comchip; Max Power Dissipation: 300mW; Transition Frequency: 100MHz; Collector-emitter Voltage-Max: 400mV; Collector Base Voltage (VCBO): 40V; Collector Emitter Saturation Voltage: 500mV; Emitter Base Voltage (VEBO): 5V; hFE Min: 200NUMBER; Number of Elements: 1NUMBER; Supplier: Digikey; Supplier Part Number: 641-1790-1-ND; Manufacturer Part Number: SS8050-G; RoHS: Yes; Category: Transistors; Stock: 74089; Pricing: 1=0.24, 10=0.148, 100=0.0921, 500=0.06754, 1000=0.05958 (USD); Mounting Technology: Surface Mount; Case/Package: TO-236-3; Max Operating Temperature: 150°C; Packaging: Cut Tape; Max Collector Current: 1.5A; Collector Emitter Breakdown Voltage: 25V; Max Breakdown Voltage: 25V; Series: -; Power Dissipation: 300mW; Height: 1.15mm; RoHS Compliant: Yes; ComponentLink1URL: http://www.comchiptech.com/admin/files/product/SS8050-G RevA181526.pdf?src-supplier=Digikey; ComponentLink1Description: http://www.comchiptech.com/admin/files/product/SS8050-G RevA181526.pdf?src-supplier=Digikey; LCSC Part Number: C164885
R1-R3 R6 R17 R19 R21 R23-R25 = RC0402JR-070RL: RES 0 OHM JUMPER 1/16W 0402; Manufacturer: Yageo; Value: 0mR; Power Rating: 62.5mW; Tolerance: 5%; Voltage Rating: 50V; Max Power Dissipation: 63mW; Temperature Coefficient: 200ppm/°C; Supplier: Digikey; Supplier Part Number: 311-0.0JRCT-ND; Manufacturer Part Number: RC0402JR-070RL; RoHS: Yes; Category: Chip SMD Resistors; Stock: 10369287; Pricing: 1=0.1, 10=0.007, 25=0.0052, 50=0.003, 100=0.002, 10000=0.00204, 20000=0.00138, 30000=0.00129, 50000=0.00109, 500000=0.001 (USD); Case/Package: 0402; Contact Plating: Tin,Matte; Case Code (Metric): 1005; Case Code (Imperial): 0402; Min Operating Temperature: -55°C; Max Operating Temperature: 155°C; Packaging: Tape and Reel; Resistor Type: Thick Film; Package Quantity: 1; Number of Terminations: 2; Termination: SMD/SMT; Features: Moisture Resistant; Series: RC; Technology: THICK FILM; Resistance Tolerance: 5%; Construction: Rectangular; Length: 1mm; Width: 0.02inch; Height: 0.016inch; Depth: 0.5mm; Reach SVHC Compliant: Unknown; Lead Free: 5697LeadFree; Military Standard: Not; RoHS Compliant: Yes; LCSC Part Number: C60485
R4 R5 R16 R18 = RC0402FR-0727RL: RES 27 OHM 1% 1/16W 0402; Manufacturer: Yageo; Power Rating: 62.5mW; Voltage Rating: 50V; Temperature Coefficient: 100ppm/°C; Max Power Dissipation: 63mW; Supplier: Digikey; Supplier Part Number: YAG3086CT-ND; Manufacturer Part Number: RC0402FR-0727RL; RoHS: Yes; Category: Chip SMD Resistors; Stock: 304110; Pricing: 1=0.1, 10=0.009, 50=0.0072, 100=0.0051, 500=0.00408, 5000=0.00306 (USD); Case/Package: 0402; Case Code (Imperial): 0402; Case Code (Metric): 1005; Weight: 2.3E-05oz; Min Operating Temperature: -55°C; Max Operating Temperature: 155°C; Value: 27R; Tolerance: 1%; Packaging: Tape and Reel; Resistor Type: Thick Film; Termination: SMD/SMT; Number of Terminations: 2; Features: Moisture Resistant; Series: RC; Construction: Rectangular; Technology: THICK FILM; Resistance Tolerance: 1%; Voltage Rating (AC): 50V; Length: 1mm; Width: 0.5mm; Height: 0.016inch; Depth: 0.5mm; Military Standard: Not; Lead Free: Lead Free; RoHS Compliant: Yes; Reach SVHC Compliant: Unknown; ComponentLink1URL: https://datasheet.ciiva.com/11808/0900766b80c66297-11808450.pdf?src-supplier=Rs; ComponentLink1Description: https://datasheet.ciiva.com/11808/0900766b80c66297-11808450.pdf?src-supplier=Rs; ComponentLink2URL: https://datasheet.ciiva.com/17044/pyu-rc0402-51-rohs-l-6-17044345.pdf?src-supplier=Future+Electronics; ComponentLink2Description: https://datasheet.ciiva.com/17044/pyu-rc0402-51-rohs-l-6-17044345.pdf?src-supplier=Future+Electronics; ComponentLink3URL: https://datasheet.ciiva.com/7849/1018594-7849927.pdf?src-supplier=Element14; ComponentLink3Description: https://datasheet.ciiva.com/7849/1018594-7849927.pdf?src-supplier=Element14; ComponentLink4URL: https://datasheet.ciiva.com/7849/1018594-7849926.pdf?src-supplier=Element14; ComponentLink4Description: https://datasheet.ciiva.com/7849/1018594-7849926.pdf?src-supplier=Element14; LCSC Part Number: C138021
R7 R11 R20 R22 R26 = RC0402FR-0710KL: RES 10K OHM 1% 1/16W 0402; Manufacturer: Yageo; Value: 10kR; Temperature Coefficient: 100ppm/°C; Voltage Rating (DC): 50V; Power Rating: 62.5mW; Max Power Dissipation: 63mW; Supplier: Digikey; Supplier Part Number: 311-10.0KLRCT-ND; Manufacturer Part Number: RC0402FR-0710KL; RoHS: Yes; Category: Chip SMD Resistors; Stock: 4057554; Pricing: 1=0.1, 10=0.009, 50=0.0072, 100=0.0051, 500=0.00408, 1000=0.00306, 10000=0.00204, 20000=0.00179, 30000=0.0016, 50000=0.00149, 70000=0.00139 (USD); Case/Package: 0402; Pins: 2; Case Code (Imperial): 0402; Case Code (Metric): 1005; Min Operating Temperature: -55°C; Max Operating Temperature: 155°C; Tolerance: 1%; Packaging: Tape and Reel; Resistor Type: Thick Film; Voltage Rating: 50V; Termination: SMD/SMT; Number of Terminations: 2; Features: Moisture Resistant; Series: RC; Resistance Tolerance: 1%; Construction: Rectangular; Length: 1mm; Width: 0.5mm; Depth: 0.5mm; Lead Pitch: 0.2mm; Reach SVHC Compliant: Unknown; Lead Free: 5697LeadFree; Military Standard: Not; RoHS Compliant: Yes; ComponentLink1URL: https://datasheet.ciiva.com/7660/38568-7660787.pdf?src-supplier=Element14; ComponentLink1Description: https://datasheet.ciiva.com/7660/38568-7660787.pdf?src-supplier=Element14; ComponentLink2URL: https://datasheet.ciiva.com/7849/1686128-7849814.pdf?src-supplier=Element14; ComponentLink2Description: https://datasheet.ciiva.com/7849/1686128-7849814.pdf?src-supplier=Element14; ComponentLink3URL: https://datasheet.ciiva.com/7983/1018594-7983486.pdf?src-supplier=Element14; ComponentLink3Description: https://datasheet.ciiva.com/7983/1018594-7983486.pdf?src-supplier=Element14; ComponentLink4URL: https://datasheet.ciiva.com/22747/1018594-22747512.pdf?src-supplier=Element14; ComponentLink4Description: https://datasheet.ciiva.com/22747/1018594-22747512.pdf?src-supplier=Element14; ComponentLink5URL: https://datasheet.ciiva.com/12667/pyu-rc0402-51-rohs-l-6-r-12667067.pdf?src-supplier=Mouser; ComponentLink5Description: https://datasheet.ciiva.com/12667/pyu-rc0402-51-rohs-l-6-r-12667067.pdf?src-supplier=Mouser; ComponentLink6URL: https://datasheet.ciiva.com/7849/1784430-7849813.pdf?src-supplier=Element14; ComponentLink6Description: https://datasheet.ciiva.com/7849/1784430-7849813.pdf?src-supplier=Element14; ComponentLink7URL: https://datasheet.ciiva.com/7849/1784430-7849815.pdf?src-supplier=Element14; ComponentLink7Description: https://datasheet.ciiva.com/7849/1784430-7849815.pdf?src-supplier=Element14; LCSC Part Number: C60490
R8 R9 R14 R15 = AF0402FR-075K1L: RES SMD 5.1K OHM 1% 1/16W 0402; Manufacturer: Yageo; Voltage Rating: 50V; Supplier: Digikey; Supplier Part Number: 13-AF0402FR-075K1LCT-ND; Manufacturer Part Number: AF0402FR-075K1L; RoHS: Yes; Category: Chip SMD Resistors; Stock: 10780; Pricing: 1=0.1, 10=0.023, 50=0.0214, 100=0.0194, 500=0.01428, 1000=0.01224, 5000=0.00918 (USD); ComponentLink1URL: https://www.yageo.com/upload/media/product/productsearch/datasheet/rchip/PYu-AF_51_RoHS_L_6.pdf?src-supplier=Digikey; ComponentLink1Description: https://www.yageo.com/upload/media/product/productsearch/datasheet/rchip/PYu-AF_51_RoHS_L_6.pdf?src-supplier=Digikey; ComponentLink2URL: https://datasheet.octopart.com/AF0402FR-075K1L-Yageo-datasheet-164730775.pdf?src-supplier=Future+Electronics; ComponentLink2Description: https://datasheet.octopart.com/AF0402FR-075K1L-Yageo-datasheet-164730775.pdf?src-supplier=Future+Electronics; LCSC Part Number: C144041
R10 = RC0402FR-074K7L: RES 4.7K OHM 1% 1/16W 0402; Manufacturer: Yageo; Voltage Rating (DC): 50V; Power Rating: 62.5mW; Value: 4.7kR; Temperature Coefficient: 100ppm/°C; Max Power Dissipation: 63mW; Supplier: Digikey; Supplier Part Number: 311-4.7KLRCT-ND; Manufacturer Part Number: RC0402FR-074K7L; RoHS: Yes; Category: Chip SMD Resistors; Stock: 4135154; Pricing: 1=0.1, 10=0.009, 50=0.0072, 100=0.0051, 500=0.00408, 1000=0.00306 (USD); Case/Package: 0402; Pins: 2; Case Code (Imperial): 0402; Case Code (Metric): 1005; Min Operating Temperature: -55°C; Max Operating Temperature: 155°C; Tolerance: 1%; Voltage Rating: 50V; Packaging: Tape and Reel; Resistor Type: Thick Film; Termination: SMD/SMT; Features: Moisture Resistant; Series: RC; Number of Terminations: 2; Resistance Tolerance: 1%; Construction: Rectangular; Voltage Rating (AC): 50V; Length: 1mm; Width: 0.5mm; Depth: 0.5mm; Reach SVHC Compliant: No; Military Standard: Not; Lead Free: Lead Free; RoHS Compliant: Yes; ComponentLink1URL: https://datasheet.ciiva.com/22661/1686128-22661342.pdf?src-supplier=Element14; ComponentLink1Description: https://datasheet.ciiva.com/22661/1686128-22661342.pdf?src-supplier=Element14; ComponentLink2URL: https://datasheet.ciiva.com/7850/1018594-7850022.pdf?src-supplier=Element14; ComponentLink2Description: https://datasheet.ciiva.com/7850/1018594-7850022.pdf?src-supplier=Element14; ComponentLink3URL: https://datasheet.ciiva.com/7850/1018594-7850023.pdf?src-supplier=Element14; ComponentLink3Description: https://datasheet.ciiva.com/7850/1018594-7850023.pdf?src-supplier=Element14; ComponentLink4URL: https://datasheet.ciiva.com/15215/getdatasheetpartid-328119-15215035.pdf?src-supplier=Verical; ComponentLink4Description: https://datasheet.ciiva.com/15215/getdatasheetpartid-328119-15215035.pdf?src-supplier=Verical; LCSC Part Number: C105871
R12 R13 = RC0100FR-071KL: RES 1K OHM 1% 1/32W 01005; Manufacturer: Yageo; Value: 1kR; Max Power Dissipation: 30mW; Temperature Coefficient: 200ppm/°C; Supplier: Digikey; Supplier Part Number: 311-1.0KDGCT-ND; Manufacturer Part Number: RC0100FR-071KL; RoHS: Yes; Category: Chip SMD Resistors; Stock: 282094; Pricing: 1=0.17, 10=0.062, 50=0.049, 100=0.0357, 500=0.03212, 1000=0.02856, 5000=0.02668 (USD); Case Code (Metric): 0402; Case Code (Imperial): 1005; Min Operating Temperature: -55°C; Max Operating Temperature: 125°C; Tolerance: 1%; Packaging: Cut Tape; Number of Terminations: 2; Features: Moisture Resistant; Series: RC; Lead Free: Lead Free; RoHS Compliant: Yes; ComponentLink1URL: https://datasheet.ciiva.com/2471/pyu-rc0100-51-rohs-l-0-2471977.pdf?src-supplier=Digikey; ComponentLink1Description: https://datasheet.ciiva.com/2471/pyu-rc0100-51-rohs-l-0-2471977.pdf?src-supplier=Digikey; ComponentLink2URL: https://datasheet.ciiva.com/2471/pyu-rc0100-51-rohs-l-0-2471978.pdf?src-supplier=Digikey; ComponentLink2Description: https://datasheet.ciiva.com/2471/pyu-rc0100-51-rohs-l-0-2471978.pdf?src-supplier=Digikey; ComponentLink3URL: https://datasheet.ciiva.com/2471/pyu-rc0100-51-rohs-l-0-2471976.pdf?src-supplier=Digikey; ComponentLink3Description: https://datasheet.ciiva.com/2471/pyu-rc0100-51-rohs-l-0-2471976.pdf?src-supplier=Digikey; LCSC Part Number: C606165
SW1 SW2 = PTS645SH50SMTR92LFS: SWITCH TACTILE SPST-NO 0.05A 12V; Manufacturer: ITT C&K; Contact Current Rating: 50mA; Contact Resistance: 100mR; Number of Positions: 2NUMBER; Supplier: Digikey; Supplier Part Number: CKN9085CT-ND; Manufacturer Part Number: PTS645SH50SMTR92LFS; RoHS: Yes; Category: Tactile Switches; Stock: 32379; Pricing: 1=0.4, 10=0.325, 25=0.2992, 100=0.2639, 250=0.24264, 500=0.22758 (USD); Lead Free: 5697LeadFree; ComponentLink1URL: https://datasheet.ciiva.com/22637/1707731-22637356.pdf?src-supplier=Element14; ComponentLink1Description: https://datasheet.ciiva.com/22637/1707731-22637356.pdf?src-supplier=Element14; ComponentLink2URL: https://datasheet.ciiva.com/14920/pts645-14920741.pdf?src-supplier=Digikey; ComponentLink2Description: https://datasheet.ciiva.com/14920/pts645-14920741.pdf?src-supplier=Digikey; LCSC Part Number: C221869
U1 = ESP32-S3-MINI-1-N8: SMD module, ESP32-S3FN8, 8 MB SPI flash, PCB antenna; Manufacturer: Espressif Systems; Supplier: Digikey; Supplier Part Number: 1965-ESP32-S3-MINI-1-N8CT-ND; Manufacturer Part Number: ESP32-S3-MINI-1-N8; RoHS: No; Category: LDO; Stock: 7665; Pricing: 1=3.1 (USD); ComponentLink1URL: https://datasheet.octopart.com/ESP32-S3-MINI-1-N8-Espressif-Systems-datasheet-165560562.pdf?src-supplier=TME; ComponentLink1Description: https://datasheet.octopart.com/ESP32-S3-MINI-1-N8-Espressif-Systems-datasheet-165560562.pdf?src-supplier=TME; LCSC Part Number: C2913206
U2 = FT231XQ-R: IC USB SERIAL FULL UART 20QFN; Manufacturer: FTDI; Supplier: Digikey; Supplier Part Number: 768-1128-1-ND; Manufacturer Part Number: FT231XQ-R; RoHS: Yes; Category: Interface ICs; Stock: 54365; Pricing: 1=2.34, 25=2.27, 100=2.2, 250=2, 500=1.82002, 1000=1.7625, 5000=1.7625 (USD); Height: 800um; Lead Free: 5697LeadFree; ComponentLink1URL: https://datasheet.ciiva.com/4787/ds-ft231x-13571-4787570.pdf?src-supplier=Mouser; ComponentLink1Description: https://datasheet.ciiva.com/4787/ds-ft231x-13571-4787570.pdf?src-supplier=Mouser; ComponentLink2URL: https://datasheet.ciiva.com/30475/0900766b811020d3-30475405.pdf?src-supplier=Rs; ComponentLink2Description: https://datasheet.ciiva.com/30475/0900766b811020d3-30475405.pdf?src-supplier=Rs; ComponentLink3URL: https://datasheet.ciiva.com/1787/ds-ft231x-1787312.pdf?src-supplier=Digikey; ComponentLink3Description: https://datasheet.ciiva.com/1787/ds-ft231x-1787312.pdf?src-supplier=Digikey; ComponentLink4URL: https://datasheet.ciiva.com/1787/ft-x-series-1787313.pdf?src-supplier=Digikey; ComponentLink4Description: https://datasheet.ciiva.com/1787/ft-x-series-1787313.pdf?src-supplier=Digikey; ComponentLink5URL: https://datasheet.ciiva.com/1787/ft-x-series-1787314.pdf?src-supplier=Digikey; ComponentLink5Description: https://datasheet.ciiva.com/1787/ft-x-series-1787314.pdf?src-supplier=Digikey; LCSC Part Number: C132159
U3 = TL1963A-33DCYR_1: IC REG LINEAR 3.3V 1.5A SOT223-4; Manufacturer: Texas Instruments; Supplier: Digikey; Supplier Part Number: 296-24897-1-ND; Manufacturer Part Number: TL1963A-33DCYR; RoHS: Yes; Category: Voltage Regulators - Linear; Stock: 2301; Pricing: 1=2.78, 10=2.075, 25=1.8984, 100=1.7043, 250=1.61188, 500=1.55614, 1000=1.51027 (USD); Thickness: 1.6mm; Lead Free: 5697LeadFree; ComponentLink1URL: https://datasheet.ciiva.com/2046/-2046068.pdf?src-supplier=Digikey; ComponentLink1Description: https://datasheet.ciiva.com/2046/-2046068.pdf?src-supplier=Digikey; LCSC Part Number: C181262

## Assembly variants
Prototype: not fitted C7 C17 R2 R5 R9 R25 R26